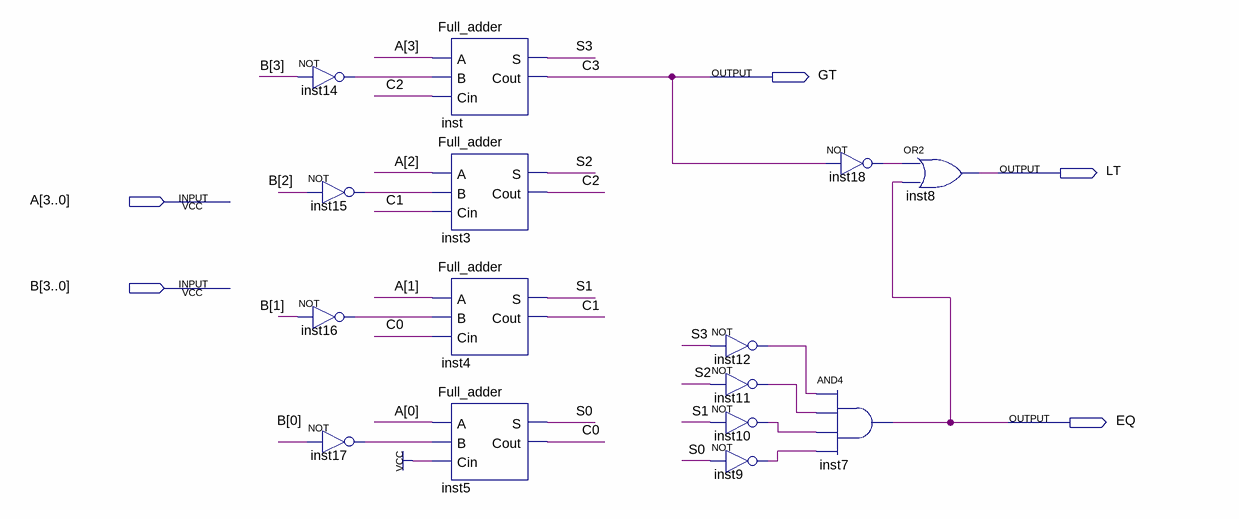
[diagram p0: schematic sheet]
// Quartus schematic Comparation4bit.bdf as structural Verilog: 15 symbols, 5 pins
module Comparation4bit (
  input  [3:0] A,
  input  [3:0] B,
  output GT,
  output LT,
  output EQ
);

  wire C0, C1, C2, inst9_out, inst10_out, inst11_out, inst12_out, inst14_out, inst15_out, inst16_out,
       inst17_out, inst18_out, S0, S1, S2, S3;

  not inst14 (inst14_out, B[3]);
  not inst15 (inst15_out, B[2]);
  not inst16 (inst16_out, B[1]);
  not inst17 (inst17_out, B[0]);
  Full_adder inst (.A(A[3]), .B(inst14_out), .Cin(C2), .S(S3), .Cout(GT));
  Full_adder inst3 (.A(A[2]), .B(inst15_out), .Cin(C1), .S(S2), .Cout(C2));
  Full_adder inst4 (.A(A[1]), .B(inst16_out), .Cin(C0), .S(S1), .Cout(C1));
  Full_adder inst5 (.A(A[0]), .B(inst17_out), .Cin(1'b1), .S(S0), .Cout(C0));
  not inst12 (inst12_out, S3);
  not inst11 (inst11_out, S2);
  not inst10 (inst10_out, S1);
  not inst9 (inst9_out, S0);
  not inst18 (inst18_out, GT);
  and inst7 (EQ, inst12_out, inst11_out, inst10_out, inst9_out);
  or inst8 (LT, inst18_out, EQ);

  // Other names for the same wires on the sheet: C3 = GT
endmodule
